# EAGLE schematic F (EAGLE 9.6.2)
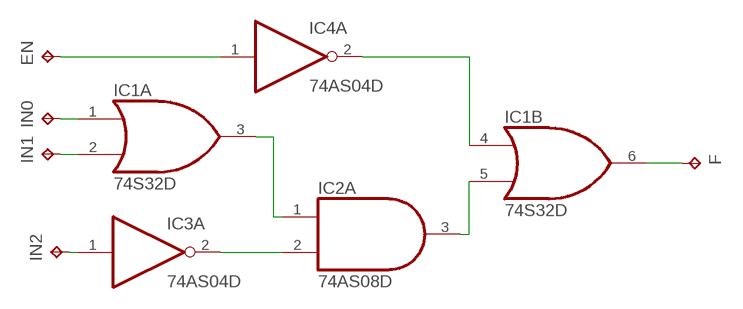
[diagram p0: schematic, sheet 1]

## Parts
EN  TPB1,27  [B1,27]
F  TPB1,27  [B1,27]
IC1  74S32D  [SO14]
IC2  74AS08D  [SO14]
IC3  74AS04D  [SO14]
IC4  74AS04D  [SO14]
IN0  TPB1,27  [B1,27]
IN1  TPB1,27  [B1,27]
IN2  TPB1,27  [B1,27]

## Nets
N$1: IC1.1(A:I0) IN0.TP
N$2: IC1.2(A:I1) IN1.TP
N$3: IC3.1(A:I) IN2.TP
N$4: IC2.2(A:I1) IC3.2(A:O)
N$5: IC1.3(A:O) IC2.1(A:I0)
N$6: EN.TP IC4.1(A:I)
N$7: IC1.4(B:I0) IC4.2(A:O)
N$8: IC1.5(B:I1) IC2.3(A:O)
N$9: F.TP IC1.6(B:O)
Unconnected: IC1.8(C:O) IC1.9(C:I0) IC1.10(C:I1) IC1.11(D:O) IC1.12(D:I0) IC1.13(D:I1) IC2.4(B:I0) IC2.5(B:I1) IC2.6(B:O) IC2.8(C:O) IC2.9(C:I0) IC2.10(C:I1) IC2.11(D:O) IC2.12(D:I0) IC2.13(D:I1) IC3.3(B:I) IC3.4(B:O) IC3.5(C:I) IC3.6(C:O) IC3.8(D:O) IC3.9(D:I) IC3.10(E:O) IC3.11(E:I) IC3.12(F:O) IC3.13(F:I) IC4.3(B:I) IC4.4(B:O) IC4.5(C:I) IC4.6(C:O) IC4.8(D:O) IC4.9(D:I) IC4.10(E:O) IC4.11(E:I) IC4.12(F:O) IC4.13(F:I)

## Power pins joined to a net without a drawn wire
GND: IC1.7(P:GND) IC2.7(P:GND) IC3.7(P:GND) IC4.7(P:GND)
VCC: IC1.14(P:VCC) IC2.14(P:VCC) IC3.14(P:VCC) IC4.14(P:VCC)

## Library data of the parts
EN F IN0 IN1 IN2 = testpad:TP: Test pad
IC1 = 74xx-us:74*32: Quad 2-input OR gate
IC2 = 74xx-us:74*08: Quad 2-input AND gate
IC3 IC4 = 74xx-us:74*04: Hex INVERTER